# Altium schematic sheet STM3205P_DigitalOutputs.SchDoc
size A3; Organization: Canis Tech; Address1: -; Address2: -; Address3: -; Address4: Indaiatuba/SP; DocumentNumber: 9; SheetNumber: 9; SheetTotal: 9; Address5: Brazil
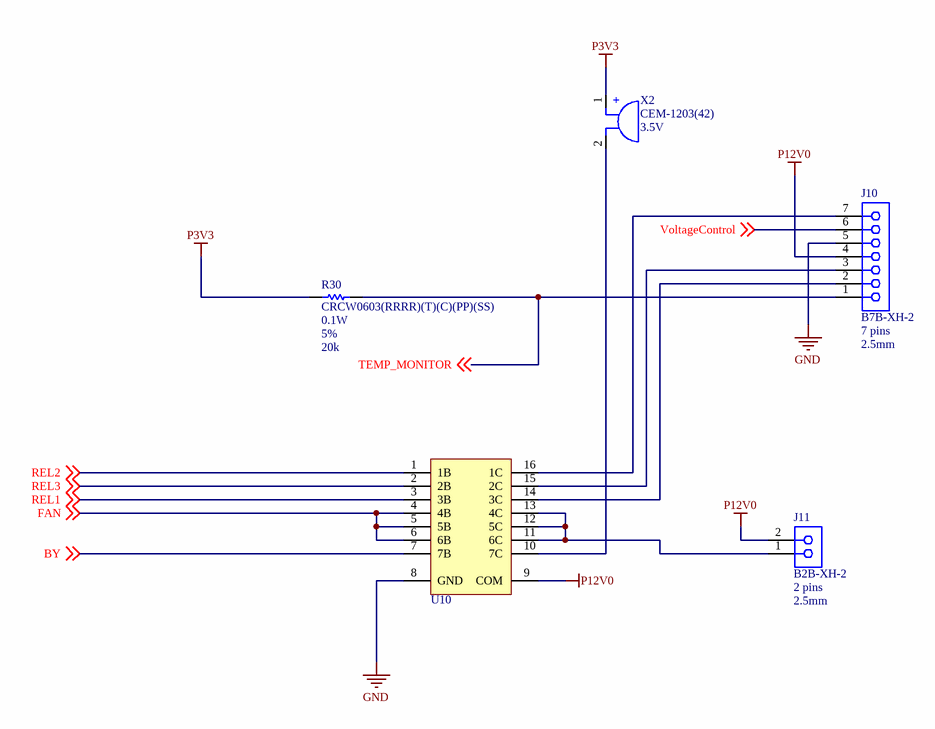
[diagram p0: STM3205P_DigitalOutputs.SchDoc]

## Parts
J10  Pins: 7 pins  Pitch: 2.5mm  [CONXH07STRMALE_2.5]  (hidden comment: B7B-XH-2)
J11  Pins: 2 pins  Pitch: 2.5mm  [CONXH02STRMALE_2.5]  (hidden comment: B2B-XH-2)
R30  value 20k  PartNumber1: CRCW0603(RRRR)(T)(C)(PP)(SS)  Power: 0.1W  Tolerance: 5%  [RES0603]  (hidden comment: Chip Resistor)
U10  ULN2003ADR  [SOIC-16-3.9mm]  (value not drawn)
X2  value 3.5V  [CEM-1203]  (hidden comment: CEM-1203(42))

## Nets
GND: J10.5 U10.8(GND)
P3V3: R30.2 X2.1(+)
P12V0: J10.4 J11.2 U10.9(COM)
BY: U10.7(7B) ; off-sheet BY
FAN: U10.4(4B) U10.5(5B) U10.6(6B) ; off-sheet FAN
REL1: U10.3(3B) ; off-sheet REL1
REL2: U10.1(1B) ; off-sheet REL2
REL3: U10.2(2B) ; off-sheet REL3
TEMP_MONITOR: J10.1 R30.1 ; off-sheet TEMP_MONITOR
VoltageControl: J10.6 ; off-sheet VoltageControl
NetJ10_2: J10.2 U10.14(3C)
NetJ10_3: J10.3 U10.15(2C)
NetJ10_7: J10.7 U10.16(1C)
NetJ11_1: J11.1 U10.11(6C) U10.12(5C) U10.13(4C)
NetU10_10: U10.10(7C) X2.2(-)

## Notes on the sheet
- Title
- Author
- Checked By
- Variant
- Size:
- Revision:
- A3
- Date:
- Project
- Time:
- Sheet
- of
- File:

## Library data of the parts
J10 = B7B-XH-2: XH Connector 7 POS HDR VERT 2.5mm; Manufacturer1: JST; LastRevisionNote: Created; Gender: Male; Published: 04-Oct-2025; LatestRevisionDate: 04-Oct-2025; PackageReference: CONXH07STRMALE_2.5; Publisher: Lucas Moraes; PackageDescription: CONXH07STRMALE_2.5; 7 Leads; Type: Pin; PartNumber1: B7B-XH-2
J11 = B2B-XH-2: XH Connector 2 POS HDR VERT 2.5mm; Manufacturer1: JST; LastRevisionNote: Created; Gender: Male; Published: 04-Oct-2025; LatestRevisionDate: 04-Oct-2025; PackageReference: CONXH02STRMALE_2.5; Publisher: Lucas Moraes; PackageDescription: CONXH02STRMALE_2.5; 2 Leads; Type: Pin; PartNumber1: B2B-XH-2
R30 = CRCW0603: Thick Film Chip Resistors with CECC Approval,  available with Established Reliability; Manufacturer1: Vishay; LatestRevisionDate: 06-May-2016; PackageReference: 0603; Publisher: Lucas Moraes; PackageDescription: SMD 0603; 2 Leads; Published: 06-May-2016
U10 = ULN2003ADR: Darlington Transistors Arrays NPN 7-Ch; Manufacturer1: Texas Instruments; Published: 15-Oct-2023; LatestRevisionDate: 15-Oct-2023; LatestRevisionNote: Created; PackageReference: SOIC-16-3.9mm; Publisher: Lucas Moraes; PackageDescription: SOIC-16-3.9mm; 16 Leads; PartNumber1: ULN2003ADR
X2 = CEM-1203(42): 12 mm, 3.5 Vo-p, 95 dB, Through Hole, Magnetic Audio Transducer Buzzer; Manufacturer1: Same Sky; Published: 05-Oct-2025; LatestRevisionDate: 05-Oct-2025; Publisher: Lucas Moraes; PackageReference: CEM-1203; PackageDescription: CEM-1203;2 Leads; Datasheet: https://www.mouser.com/datasheet/3/6118/1/cem-1203-42-.pdf; PartNumber1: CEM-1203(42)